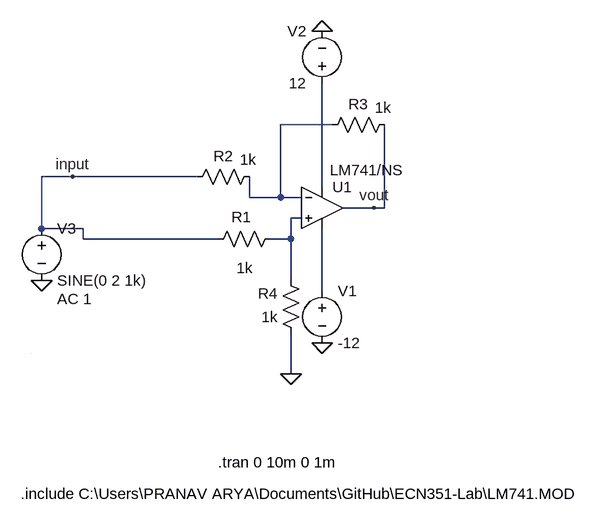
[diagram p0: schematic Subtractor.asc]
Subtractor.asc, the LTspice schematic file:
Version 4
SHEET 1 916 680
WIRE 464 -352 384 -352
WIRE 64 -272 16 -272
WIRE 256 -272 64 -272
WIRE 448 -256 448 -416
WIRE 336 -240 336 -272
WIRE 384 -240 384 -352
WIRE 384 -240 336 -240
WIRE 416 -240 384 -240
WIRE 528 -224 480 -224
WIRE 544 -224 544 -352
WIRE 544 -224 528 -224
WIRE 416 -208 400 -208
WIRE 16 -192 16 -272
WIRE 80 -192 16 -192
WIRE 80 -176 80 -192
WIRE 288 -176 80 -176
WIRE 400 -176 400 -208
WIRE 400 -176 368 -176
WIRE 400 -112 400 -176
WIRE 448 -96 448 -192
WIRE 400 32 400 -32
WIRE 0 0 0 0
FLAG 448 -16 0
FLAG 448 -496 0
FLAG 16 -112 0
FLAG 400 32 0
FLAG 528 -224 vout
FLAG 64 -272 input
SYMBOL OpAmps\\opamp2 448 -288 R0
WINDOW 3 12 6 Left 2
SYMATTR Value LM741/NS
SYMATTR InstName U1
SYMBOL voltage 448 -112 R0
WINDOW 123 0 0 Left 0
WINDOW 39 0 0 Left 0
SYMATTR InstName V1
SYMATTR Value -12
SYMBOL voltage 448 -400 R180
WINDOW 0 24 96 Left 2
WINDOW 3 24 16 Left 2
WINDOW 123 0 0 Left 0
WINDOW 39 0 0 Left 0
SYMATTR InstName V2
SYMATTR Value 12
SYMBOL res 384 -192 R90
WINDOW 0 -2 60 VBottom 2
WINDOW 3 45 55 VTop 2
SYMATTR InstName R1
SYMATTR Value 1k
SYMBOL res 352 -288 R90
WINDOW 0 0 56 VBottom 2
WINDOW 3 -26 18 VTop 2
SYMATTR InstName R2
SYMATTR Value 1k
SYMBOL voltage 16 -208 R0
WINDOW 123 24 124 Left 2
WINDOW 39 0 0 Left 0
SYMATTR Value2 AC 1
SYMATTR InstName V3
SYMATTR Value SINE(0 2 1k)
SYMBOL res 560 -368 R90
WINDOW 0 0 56 VBottom 2
WINDOW 3 -26 18 VTop 2
SYMATTR InstName R3
SYMATTR Value 1k
SYMBOL res 416 -16 R180
WINDOW 0 36 76 Left 2
WINDOW 3 36 40 Left 2
SYMATTR InstName R4
SYMATTR Value 1k
TEXT -16 216 Left 2 !.include C:\\Users\\PRANAV ARYA\\Documents\\GitHub\\ECN351-Lab\\LM741.MOD
TEXT 288 168 Left 2 !.tran 0 10m 0 1m

The netlist it stands for:
* Subtractor.asc
XU1 N003 N001 N002 N004 vout LM741/NS  ; pins In+ In- V+ V- OUT
V1 N004 0 -12
V2 N002 0 12
R1 N003 input 1k
R2 N001 input 1k
V3 input 0 SINE(0 2 1k) AC 1
R3 vout N001 1k
R4 0 N003 1k
.include C:\Users\PRANAV ARYA\Documents\GitHub\ECN351-Lab\LM741.MOD
.tran 0 10m 0 1m
.backanno
.end